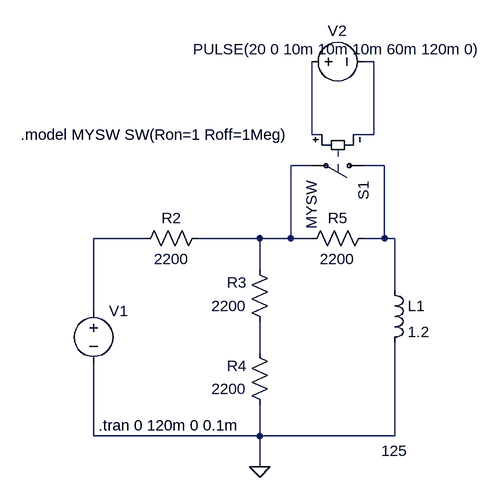
[diagram p0: schematic scheme-switch.asc]
scheme-switch.asc, the LTspice schematic file:
Version 4
SHEET 1 1008 680
WIRE 656 -400 640 -400
WIRE 560 -288 560 -400
WIRE 576 -288 560 -288
WIRE 656 -288 656 -400
WIRE 656 -288 624 -288
WIRE 560 -240 528 -240
WIRE 672 -240 640 -240
WIRE 304 -128 224 -128
WIRE 480 -128 384 -128
WIRE 528 -128 528 -240
WIRE 528 -128 480 -128
WIRE 560 -128 528 -128
WIRE 672 -128 672 -240
WIRE 672 -128 640 -128
WIRE 688 -128 672 -128
WIRE 480 -80 480 -128
WIRE 688 -48 688 -128
WIRE 224 -16 224 -128
WIRE 480 48 480 0
WIRE 224 176 224 64
WIRE 480 176 480 128
WIRE 480 176 224 176
WIRE 688 176 688 32
WIRE 688 176 480 176
WIRE 480 224 480 176
FLAG 480 224 0
SYMBOL voltage 224 -32 R0
WINDOW 123 0 0 Left 0
WINDOW 39 0 0 Left 0
WINDOW 3 484 231 Right 2
SYMATTR Value 125
SYMATTR InstName V1
SYMBOL ind 672 -64 R0
SYMATTR InstName L1
SYMATTR Value 1.2
SYMBOL res 400 -144 R90
WINDOW 0 0 56 VBottom 2
WINDOW 3 32 56 VTop 2
SYMATTR InstName R2
SYMATTR Value 2200
SYMBOL res 496 16 R180
WINDOW 0 36 76 Left 2
WINDOW 3 36 40 Left 2
SYMATTR InstName R3
SYMATTR Value 2200
SYMBOL res 496 144 R180
WINDOW 0 36 76 Left 2
WINDOW 3 36 40 Left 2
SYMATTR InstName R4
SYMATTR Value 2200
SYMBOL res 544 -112 R270
WINDOW 0 32 56 VTop 2
WINDOW 3 0 56 VBottom 2
SYMATTR InstName R5
SYMATTR Value 2200
SYMBOL sw 656 -240 R90
SYMATTR InstName S1
SYMATTR Value MYSW
SYMBOL voltage 544 -400 R270
WINDOW 0 32 56 VTop 2
WINDOW 3 4 56 VTop 2
WINDOW 123 0 0 Left 0
WINDOW 39 0 0 Left 0
SYMATTR InstName V2
SYMATTR Value PULSE(20 0 10m 10m 10m 60m 120m 0)
TEXT 232 160 Left 2 !.tran 0 120m 0 0.1m
TEXT 112 -288 Left 2 !.model MYSW SW(Ron=1 Roff=1Meg)

The netlist it stands for:
* scheme-switch.asc
V1 N005 0 125
L1 N004 0 1.2
R2 N003 N005 2200
R3 N006 N003 2200
R4 0 N006 2200
R5 N003 N004 2200
S1 N004 N003 N002 N001 MYSW
V2 N002 N001 PULSE(20 0 10m 10m 10m 60m 120m 0)
.tran 0 120m 0 0.1m
.model MYSW SW(Ron=1 Roff=1Meg)
.backanno
.end